# Altium project Audio_Blade_Mic_Array.PrjPcb (part 3 of 3)

## Sheet CPLD_2.SchDoc: Intel Max 10 CPLD: Power & GPIO
size 279 x 215 mm; CompanyName: Flat Earth Inc.; DrawnBy: Connor Dack; Engineer: Connor Dack; Address1: 985 Technology Blvd; Address2: Suite 102; Address3: Bozeman, MT, 59718; DocumentNumber: 7; Revision: 0.0; SheetNumber: 7; SheetTotal: 8
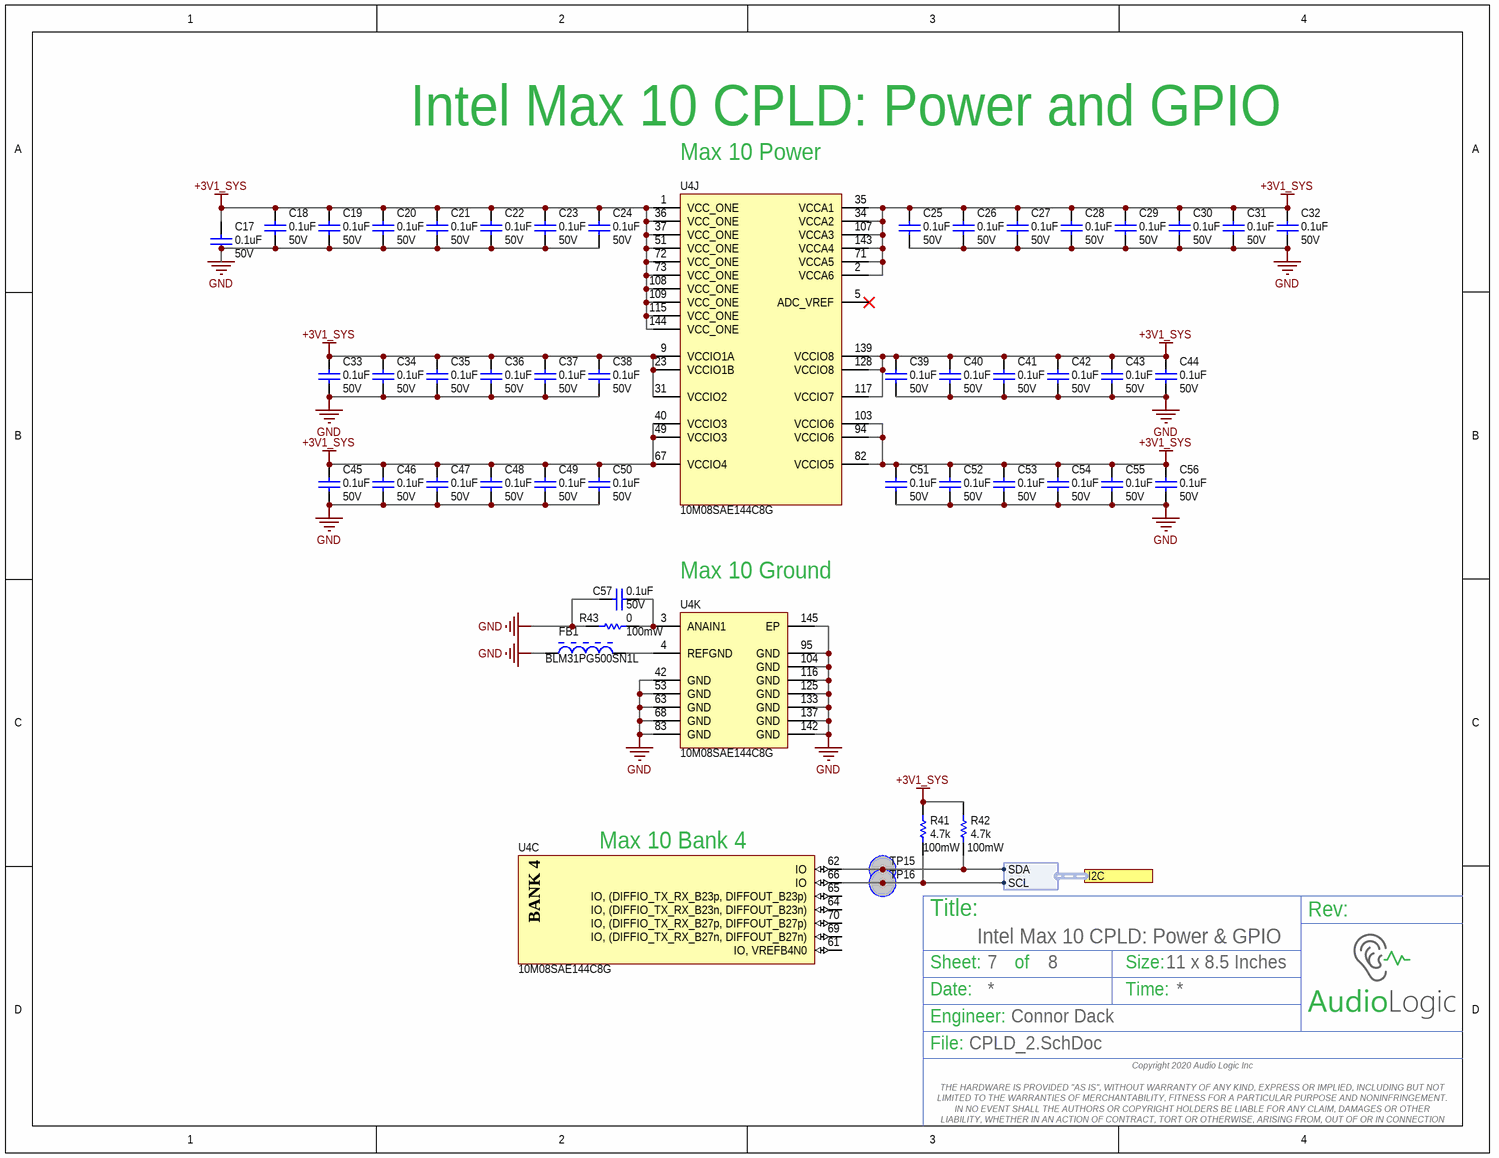
[diagram p6: CPLD_2.SchDoc]

### Parts
C17  Capacitance: 0.1uF  Voltage Rating: 50V  [2-0402_L]  (hidden comment: UMK105B7104KVHF)
C18  Capacitance: 0.1uF  Voltage Rating: 50V  [2-0402_L]  (hidden comment: UMK105B7104KVHF)
C19  Capacitance: 0.1uF  Voltage Rating: 50V  [2-0402_L]  (hidden comment: UMK105B7104KVHF)
C20  Capacitance: 0.1uF  Voltage Rating: 50V  [2-0402_L]  (hidden comment: UMK105B7104KVHF)
C21  Capacitance: 0.1uF  Voltage Rating: 50V  [2-0402_L]  (hidden comment: UMK105B7104KVHF)
C22  Capacitance: 0.1uF  Voltage Rating: 50V  [2-0402_L]  (hidden comment: UMK105B7104KVHF)
C23  Capacitance: 0.1uF  Voltage Rating: 50V  [2-0402_L]  (hidden comment: UMK105B7104KVHF)
C24  Capacitance: 0.1uF  Voltage Rating: 50V  [2-0402_L]  (hidden comment: UMK105B7104KVHF)
C25  Capacitance: 0.1uF  Voltage Rating: 50V  [2-0402_L]  (hidden comment: UMK105B7104KVHF)
C26  Capacitance: 0.1uF  Voltage Rating: 50V  [2-0402_L]  (hidden comment: UMK105B7104KVHF)
C27  Capacitance: 0.1uF  Voltage Rating: 50V  [2-0402_L]  (hidden comment: UMK105B7104KVHF)
C28  Capacitance: 0.1uF  Voltage Rating: 50V  [2-0402_L]  (hidden comment: UMK105B7104KVHF)
C29  Capacitance: 0.1uF  Voltage Rating: 50V  [2-0402_L]  (hidden comment: UMK105B7104KVHF)
C30  Capacitance: 0.1uF  Voltage Rating: 50V  [2-0402_L]  (hidden comment: UMK105B7104KVHF)
C31  Capacitance: 0.1uF  Voltage Rating: 50V  [2-0402_L]  (hidden comment: UMK105B7104KVHF)
C32  Capacitance: 0.1uF  Voltage Rating: 50V  [2-0402_L]  (hidden comment: UMK105B7104KVHF)
C33  Capacitance: 0.1uF  Voltage Rating: 50V  [2-0402_L]  (hidden comment: UMK105B7104KVHF)
C34  Capacitance: 0.1uF  Voltage Rating: 50V  [2-0402_L]  (hidden comment: UMK105B7104KVHF)
C35  Capacitance: 0.1uF  Voltage Rating: 50V  [2-0402_L]  (hidden comment: UMK105B7104KVHF)
C36  Capacitance: 0.1uF  Voltage Rating: 50V  [2-0402_L]  (hidden comment: UMK105B7104KVHF)
C37  Capacitance: 0.1uF  Voltage Rating: 50V  [2-0402_L]  (hidden comment: UMK105B7104KVHF)
C38  Capacitance: 0.1uF  Voltage Rating: 50V  [2-0402_L]  (hidden comment: UMK105B7104KVHF)
C39  Capacitance: 0.1uF  Voltage Rating: 50V  [2-0402_L]  (hidden comment: UMK105B7104KVHF)
C40  Capacitance: 0.1uF  Voltage Rating: 50V  [2-0402_L]  (hidden comment: UMK105B7104KVHF)
C41  Capacitance: 0.1uF  Voltage Rating: 50V  [2-0402_L]  (hidden comment: UMK105B7104KVHF)
C42  Capacitance: 0.1uF  Voltage Rating: 50V  [2-0402_L]  (hidden comment: UMK105B7104KVHF)
C43  Capacitance: 0.1uF  Voltage Rating: 50V  [2-0402_L]  (hidden comment: UMK105B7104KVHF)
C44  Capacitance: 0.1uF  Voltage Rating: 50V  [2-0402_L]  (hidden comment: UMK105B7104KVHF)
C45  Capacitance: 0.1uF  Voltage Rating: 50V  [2-0402_L]  (hidden comment: UMK105B7104KVHF)
C46  Capacitance: 0.1uF  Voltage Rating: 50V  [2-0402_L]  (hidden comment: UMK105B7104KVHF)
C47  Capacitance: 0.1uF  Voltage Rating: 50V  [2-0402_L]  (hidden comment: UMK105B7104KVHF)
C48  Capacitance: 0.1uF  Voltage Rating: 50V  [2-0402_L]  (hidden comment: UMK105B7104KVHF)
C49  Capacitance: 0.1uF  Voltage Rating: 50V  [2-0402_L]  (hidden comment: UMK105B7104KVHF)
C50  Capacitance: 0.1uF  Voltage Rating: 50V  [2-0402_L]  (hidden comment: UMK105B7104KVHF)
C51  Capacitance: 0.1uF  Voltage Rating: 50V  [2-0402_L]  (hidden comment: UMK105B7104KVHF)
C52  Capacitance: 0.1uF  Voltage Rating: 50V  [2-0402_L]  (hidden comment: UMK105B7104KVHF)
C53  Capacitance: 0.1uF  Voltage Rating: 50V  [2-0402_L]  (hidden comment: UMK105B7104KVHF)
C54  Capacitance: 0.1uF  Voltage Rating: 50V  [2-0402_L]  (hidden comment: UMK105B7104KVHF)
C55  Capacitance: 0.1uF  Voltage Rating: 50V  [2-0402_L]  (hidden comment: UMK105B7104KVHF)
C56  Capacitance: 0.1uF  Voltage Rating: 50V  [2-0402_L]  (hidden comment: UMK105B7104KVHF)
C57  Capacitance: 0.1uF  Voltage Rating: 50V  [2-0402_L]  (hidden comment: UMK105B7104KVHF)
FB1  BLM31PG500SN1L  [MURA-BLM31-B35-CHIP-2_V1]
R41  Power (Watts): 100mW  Resistance (Ohms): 4.7k  [3-0603_R_L]  (hidden comment: ERJ-3EKF4701V)
R42  Power (Watts): 100mW  Resistance (Ohms): 4.7k  [3-0603_R_L]  (hidden comment: ERJ-3EKF4701V)
R43  Resistance: 0  Power Rating: 100mW  [RESC1005X40X25LL05T10]  (hidden comment: ERJ-2GE0R00X)
TP15  Testpoint  [Testpoint_SMT]  (value not drawn)  (no BOM)
TP16  Testpoint  [Testpoint_SMT]  (value not drawn)  (no BOM)
U4  10M08SAE144C8G  [ALTR-EQFP144_A165_D2-500_M]  (parts C,J,K of 11)

### Ports
I2C (harness I2C)

### Harnesses
I2C: SCL, SDA

### Nets
+3V1_SYS: C17.1 C18.1 C19.1 C20.1 C21.1 C22.1 C23.1 C24.1 C25.1 C26.1 C27.1 C28.1 C29.1 C30.1 C31.1 C32.1 C33.1 C34.1 C35.1 C36.1 C37.1 C38.1 C39.1 C40.1 C41.1 C42.1 C43.1 C44.1 C45.1 C46.1 C47.1 C48.1 C49.1 C50.1 C51.1 C52.1 C53.1 C54.1 C55.1 C56.1 R41.2 R42.2 U4.1(VCC_ONE) U4.2(VCCA6) U4.9(VCCIO1A) U4.23(VCCIO1B) U4.31(VCCIO2) U4.34(VCCA2) U4.35(VCCA1) U4.36(VCC_ONE) U4.37(VCC_ONE) U4.40(VCCIO3) U4.49(VCCIO3) U4.51(VCC_ONE) U4.67(VCCIO4) U4.71(VCCA5) U4.72(VCC_ONE) U4.73(VCC_ONE) U4.82(VCCIO5) U4.94(VCCIO6) U4.103(VCCIO6) U4.107(VCCA3) U4.108(VCC_ONE) U4.109(VCC_ONE) U4.115(VCC_ONE) U4.117(VCCIO7) U4.128(VCCIO8) U4.139(VCCIO8) U4.143(VCCA4) U4.144(VCC_ONE)
GND: C17.2 C18.2 C19.2 C20.2 C21.2 C22.2 C23.2 C24.2 C25.2 C26.2 C27.2 C28.2 C29.2 C30.2 C31.2 C32.2 C33.2 C34.2 C35.2 C36.2 C37.2 C38.2 C39.2 C40.2 C41.2 C42.2 C43.2 C44.2 C45.2 C46.2 C47.2 C48.2 C49.2 C50.2 C51.2 C52.2 C53.2 C54.2 C55.2 C56.2 C57.2 FB1.1 R43.1 U4.42(GND) U4.53(GND) U4.63(GND) U4.68(GND) U4.83(GND) U4.95(GND) U4.104(GND) U4.116(GND) U4.125(GND) U4.133(GND) U4.137(GND) U4.142(GND) U4.145(EP)
SCL: R41.1 TP16.1 U4.66(IO) ; port I2C.SCL
SDA: R42.1 TP15.1 U4.62(IO) ; port I2C.SDA
NetC57_1: C57.1 R43.2 U4.3(ANAIN1)
NetFB1_2: FB1.2 U4.4(REFGND)

Not connected (* = marked no-connect by the designer): U4 5(ADC_VREF)* 61(IO,_VREFB4N0) 64(IO,_(DIFFIO_TX_RX_B23n,_DIFFOUT_B23n)) 65(IO,_(DIFFIO_TX_RX_B23p,_DIFFOUT_B23p)) 69(IO,_(DIFFIO_TX_RX_B27n,_DIFFOUT_B27n)) 70(IO,_(DIFFIO_TX_RX_B27p,_DIFFOUT_B27p))

### Notes on the sheet
- Intel Max 10 CPLD: Power and GPIO
- (near U4) Max 10 Power
- Max 10 Ground
- Max 10 Bank 4
- Title:
- Sheet:
- of
- Size:
- 11 x 8.5 Inches
- Rev:
- Date:
- Engineer:
- Time:
- File:
- Copyright 2020 Audio Logic Inc
  THE HARDWARE IS PROVIDED "AS IS", WITHOUT WARRANTY OF ANY KIND, EXPRESS OR IMPLIED, INCLUDING BUT NOT LIMITED TO THE WARRANTIES OF MERCHANTABILITY, FITNESS FOR A PARTICULAR PURPOSE AND NONINFRINGEMENT. IN NO EVENT SHALL THE AUTHORS OR COPYRIGHT HOLDERS BE LIABLE FOR ANY CLAIM, DAMAGES OR OTHER LIABILITY, WHETHER IN AN ACTION OF CONTRACT, TORT OR OTHERWISE, ARISING FROM, OUT OF OR IN CONNECTION WITH THE HARDWARE OR THE USE OR OTHER DEALINGS IN THE HARDWARE.
- (in symbol 10M08SAE144C8G, part C) BANK 4

### Library data of the parts
C17-C57 = UMK105B7104KVHF: CAP CER 0.1uF 50V X7R +/-10% 0402 AEC-Q200; Manufacturer: Taiyo Yuden; Tolerance: 10%; Supplier 1: Digi-Key; Manufacturer Part Number: UMK105B7104KVHF; Stock 1: 100000; Pricing 1: 1=0.23, 10=0.165, 100=0.0775, 500=0.05436, 1000=0.04501, 2500=0.04189, 5000=0.03832 (USD); Packaging: Tape and Reel; ComponentLink1URL: http://www.yuden.co.jp/productdata/catalog/en/mlcc01_hq_e.pdf; ComponentLink1Description: http://www.yuden.co.jp/productdata/catalog/en/mlcc01_hq_e.pdf; Supplier Part Number 1: 587-4330-1-ND; Mount: Surface Mount; Case/Package: 0402; Case Code (Metric): 1005; Case Code (Imperial): 0402; Min Operating Temperature: -55°C; Max Operating Temperature: 125°C; Package Quantity: 10000; Dielectric: X7R; Voltage Rating (DC): 50V; Length: 0.039inch; Height: 0.5mm; Width: 0.02inch; Thickness: 0.022inch; ComponentLink2URL: http://ds.yuden.co.jp/TYCOMPAS/ut/detail.do?productNo=UMK105B7104KVHF&fileName=UMK105B7104KVHF_SS&mode=specSheetDownload; ComponentLink2Description: http://ds.yuden.co.jp/TYCOMPAS/ut/detail.do?productNo=UMK105B7104KVHF&fileName=UMK105B7104KVHF_SS&mode=specSheetDownload; ComponentLink3URL: http://www.mouser.com/ds/2/396/mlcc11_hq_e-541564.pdf; ComponentLink3Description: http://www.mouser.com/ds/2/396/mlcc11_hq_e-541564.pdf; ComponentLink4URL: http://ds.yuden.co.jp/TYCOMPAS/ut/detail.do?productNo=UMK105B7104KVHF&dataUnit=M; ComponentLink4Description: http://ds.yuden.co.jp/TYCOMPAS/ut/detail.do?productNo=UMK105B7104KVHF&dataUnit=M; Weight: 2.3E-05oz; Termination: SMD/SMT
FB1 = CMP-0686-00735-2: Chip Ferrite Bead for Power Lines, 50 Ohm, 3500 mA, -55 to 125 degC, 3.2 x 1.6 x 1.3 mm SMD, Tape and Reel; Manufacturer: Murata; DC Resistance: 0.015 Ohm Max.; Rated Current: 3500 mA; Impedance (at 100 MHz): 50 Ohm Typ.; ComponentLink1Description: Manufacturer URL; DatasheetVersion: 08/2013; PackageReference: BLM31-2; ComponentLink1URL: http://www.murata.com/; ComponentLink3URL: http://www.murata.com/products/catalog/pdf/c31e.pdf; Packing: Tape and Reel; PartNumber: BLM31PG500SN1L; PackageDescription: 2-Pin Chip, Body 3.2 x 1.6 mm; ComponentLink3Description: Package Specification; ComponentLink2URL: http://www.murata.com/products/catalog/pdf/c31e.pdf; Operating Temperature Range: -55 to 125 degC; Mounting Technology: Surface Mount; ComponentLink2Description: Datasheet
R41 R42 = ERJ-3EKF4701V: RES SMD 4.7K OHM 1% 1/10W 0603; Manufacturer: Panasonic Electronic Components; Temperature Coefficient: ±100ppm/°C; Supplier 1: Digi-Key; Manufacturer Part Number: ERJ-3EKF4701V; RoHS: RoHS Compliant; Category: Resistors; Stock 1: 1874817; Pricing 1: 1=0.1, 50=0.0114, 100=0.0084, 250=0.00644, 500=0.00514, 1000=0.00379 (USD); Packaging: Cut Tape (CT); Part Status: Active; Tolerance: ±1%; Composition: Thick Film; Features: Automotive AEC-Q200; Operating Temperature: -55°C ~ 155°C; Package / Case: 0603 (1608 Metric); Supplier Device Package: 0603; Size / Dimension: 0.063" L x 0.031" W (1.60mm x 0.80mm); Height: 0.022" (0.55mm); Number of Terminations: 2; ComponentLink1URL: http://industrial.panasonic.com/www-cgi/jvcr13pz.cgi?E+PZ+3+AOA0002+ERJ3EKF4701V+7+WW; ComponentLink1Description: http://industrial.panasonic.com/www-cgi/jvcr13pz.cgi?E+PZ+3+AOA0002+ERJ3EKF4701V+7+WW; Supplier Part Number 1: P4.70KHCT-ND
R43 = CMP-2002-06455-1: RES SMD 0 OHM JUMPER 1/10W 0402; Manufacturer: Panasonic; Part Number: ERJ-S020R00X; Voltage Rating: 50V; Tolerance: 5%; Temperature Coefficient: 600ppm/°C; Supplier 1: Digi-Key; Supplier Part Number 1: P0.0JCT-ND; Manufacturer Part Number: ERJ-2GE0R00X; RoHS: Yes; Category: Chip SMD Resistors; Stock 1: 18087276; Pricing 1: 1=0.10000, 10=0.03000, 25=0.02160, 50=0.01640, 100=0.01210, 250=0.00924, 500=0.00740, 1000=0.00545, 5000=0.00391 (USD); Mount: Surface Mount; Case/Package: 0402; Case Code (Metric): 1005; Case Code (Imperial): 0402; Contact Plating: Tin; Min Operating Temperature: -55°C; Max Operating Temperature: 155°C; Packaging: Tape and Reel; Package Quantity: 1; Composition: Thick Film; Number of Terminations: 2; Max Power Dissipation: 100mW; Termination: SMD/SMT; Military Standard: Not; Voltage Rating (DC): 50V; Features: Automotive AEC-Q200; Length: 1mm; Height: 0.35mm; Width: 0.02inch; Depth: 0.5mm; Radiation Hardening: No; Lead Free: Lead Free; REACH SVHC: No SVHC; ComponentLink1URL: https://datasheet.ciiva.com/11821/0900766b80f806dd-11821176.pdf?src-supplier=RSComponents; ComponentLink1Description: https://datasheet.ciiva.com/11821/0900766b80f806dd-11821176.pdf?src-supplier=RSComponents; ComponentLink2URL: https://datasheet.ciiva.com/46389/1678796-46389518.pdf?src-supplier=Element14; ComponentLink2Description: https://datasheet.ciiva.com/46389/1678796-46389518.pdf?src-supplier=Element14; ComponentLink3URL: https://datasheet.ciiva.com/16778/70260739-16778335.pdf?src-supplier=Allied+Electronics; ComponentLink3Description: https://datasheet.ciiva.com/16778/70260739-16778335.pdf?src-supplier=Allied+Electronics; ComponentLink4URL: https://datasheet.ciiva.com/16783/70260739-16783734.pdf?src-supplier=Allied+Electronics; ComponentLink4Description: https://datasheet.ciiva.com/16783/70260739-16783734.pdf?src-supplier=Allied+Electronics; ComponentLink5URL: https://datasheet.ciiva.com/17215/aoa0000ce1-17215386.pdf?src-supplier=Avnet+Europe; ComponentLink5Description: https://datasheet.ciiva.com/17215/aoa0000ce1-17215386.pdf?src-supplier=Avnet+Europe; ComponentLink6URL: https://datasheet.ciiva.com/5959/1678796-5959692.pdf?src-supplier=Farnell; ComponentLink6Description: https://datasheet.ciiva.com/5959/1678796-5959692.pdf?src-supplier=Farnell; ComponentLink7URL: https://datasheet.ciiva.com/48531/aoa0000ce1-48531077.pdf?src-supplier=Avnet; ComponentLink7Description: https://datasheet.ciiva.com/48531/aoa0000ce1-48531077.pdf?src-supplier=Avnet; ComponentLink8URL: https://datasheet.ciiva.com/43460/1678796-43460347.pdf?src-supplier=Farnell; ComponentLink8Description: https://datasheet.ciiva.com/43460/1678796-43460347.pdf?src-supplier=Farnell; ComponentLink9URL: https://datasheet.ciiva.com/30097/4aoa0000ce1-30097116.pdf?src-supplier=Onlinecomponents.com; ComponentLink9Description: https://datasheet.ciiva.com/30097/4aoa0000ce1-30097116.pdf?src-supplier=Onlinecomponents.com; ComponentLink10URL: https://datasheet.ciiva.com/28695/1678796-28695758.pdf?src-supplier=Element14; ComponentLink10Description: https://datasheet.ciiva.com/28695/1678796-28695758.pdf?src-supplier=Element14
TP15 TP16 = Testpoint_SMT: Testpoint, 1-Pin, SMT; System: Connector
U4 = 10M08SAE144C8G: MAX 10 Family FPGA, 1.15 to 1.25 V Supply, 101 GPIO Pins, 8 K Logic Elements, 144-Pin EQFP, Speed Grade 8, Commercial Grade, RoHS Compliant, Engineering Sample; Manufacturer: Altera; Package Version: Rev. 2.0, 03/2015; Package Reference: EQFP144_A165_D2-500; Package Description: 144-Pin Plastic Enhanced Quad Flat Package, Body 20 x 20 mm, Pitch 0.5 mm; Manufacturer URL: https://www.altera.com/; Datasheet Version: Jan-16; Package URL: https://www.altera.com/content/dam/altera-www/global/en_US/pdfs/literature/packaging/04r00476-01.pdf; Datasheet URL: http://www.altera.com/literature/hb/max-10/m10_datasheet.pdf

## Sheet System_Architecture.SchDoc: System Architecture
size 279 x 215 mm; CompanyName: Flat Earth Inc.; DrawnBy: Connor Dack; Engineer: Connor Dack; Address1: 985 Technology Blvd; Address2: Suite 102; Address3: Bozeman, MT, 59718; DocumentNumber: 3; Revision: 0.0; SheetNumber: 3; SheetTotal: 8
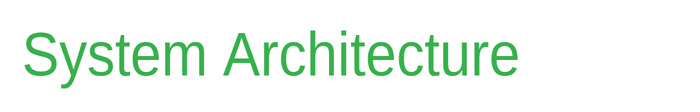
[diagram p7: System_Architecture.SchDoc]

### Notes on the sheet
- System Architecture
- Title:
- Sheet:
- of
- Size:
- 11 x 8.5 Inches
- Rev:
- Date:
- Engineer:
- Time:
- File:
- Copyright 2020 Audio Logic Inc
  THE HARDWARE IS PROVIDED "AS IS", WITHOUT WARRANTY OF ANY KIND, EXPRESS OR IMPLIED, INCLUDING BUT NOT LIMITED TO THE WARRANTIES OF MERCHANTABILITY, FITNESS FOR A PARTICULAR PURPOSE AND NONINFRINGEMENT. IN NO EVENT SHALL THE AUTHORS OR COPYRIGHT HOLDERS BE LIABLE FOR ANY CLAIM, DAMAGES OR OTHER LIABILITY, WHETHER IN AN ACTION OF CONTRACT, TORT OR OTHERWISE, ARISING FROM, OUT OF OR IN CONNECTION WITH THE HARDWARE OR THE USE OR OTHER DEALINGS IN THE HARDWARE.

## Nets that join several sheets
+3V1_SYS: RJ45_Power_Reg (14 pins), CPLD (18 pins), Peripherals (55 pins), CPLD_2 (70 pins)
GND: RJ45_Power_Reg (31 pins), CPLD (17 pins), Peripherals (43 pins), CPLD_2 (56 pins)
MIC_SCK_1: CPLD (R32.1), Peripherals (MK1.6)
MIC_SCK_2: CPLD (R31.1), Peripherals (MK2.6)
MIC_SCK_3: CPLD (R25.1), Peripherals (MK3.6)
MIC_SCK_4: CPLD (R24.1), Peripherals (MK4.6)
MIC_SCK_5: CPLD (R26.1), Peripherals (MK5.6)
MIC_SCK_6: CPLD (R30.1), Peripherals (MK6.6)
MIC_SCK_7: CPLD (R22.1), Peripherals (MK7.6)
MIC_SCK_8: CPLD (R23.1), Peripherals (MK8.6)
MIC_SCK_9: CPLD (R34.1), Peripherals (MK9.6)
MIC_SCK_10: CPLD (R33.1), Peripherals (MK10.6)
MIC_SCK_11: CPLD (R38.1), Peripherals (MK11.6)
MIC_SCK_12: CPLD (R37.1), Peripherals (MK12.6)
MIC_SCK_13: CPLD (R35.1), Peripherals (MK13.6)
MIC_SCK_14: CPLD (R36.1), Peripherals (MK14.6)
MIC_SCK_15: CPLD (R39.1), Peripherals (MK15.6)
MIC_SCK_16: CPLD (R40.1), Peripherals (MK16.6)
MIC_SD_1: CPLD (TP14.1 U4.25), Peripherals (R44.1)
MIC_SD_2: CPLD (U4.43), Peripherals (R45.1)
MIC_SD_3: CPLD (U4.57), Peripherals (R46.1)
MIC_SD_4: CPLD (U4.84), Peripherals (R47.1)
MIC_SD_5: CPLD (U4.32), Peripherals (R48.1)
MIC_SD_6: CPLD (U4.38), Peripherals (R49.1)
MIC_SD_7: CPLD (U4.78), Peripherals (R50.1)
MIC_SD_8: CPLD (U4.76), Peripherals (R51.1)
MIC_SD_9: CPLD (U4.6), Peripherals (R52.1)
MIC_SD_10: CPLD (U4.140), Peripherals (R54.1)
MIC_SD_11: CPLD (U4.106), Peripherals (R55.1)
MIC_SD_12: CPLD (U4.100), Peripherals (R56.1)
MIC_SD_13: CPLD (U4.11), Peripherals (R57.1)
MIC_SD_14: CPLD (U4.135), Peripherals (R58.1)
MIC_SD_15: CPLD (U4.119), Peripherals (R59.1)
MIC_SD_16: CPLD (U4.92), Peripherals (R60.1)
MIC_WS_1: CPLD (TP9.1 U4.30), Peripherals (MK1.5)
MIC_WS_2: CPLD (U4.46), Peripherals (MK2.5)
MIC_WS_3: CPLD (U4.60), Peripherals (MK3.5)
MIC_WS_4: CPLD (U4.87), Peripherals (MK4.5)
MIC_WS_5: CPLD (U4.33), Peripherals (MK5.5)
MIC_WS_6: CPLD (U4.41), Peripherals (MK6.5)
MIC_WS_7: CPLD (U4.74), Peripherals (MK7.5)
MIC_WS_8: CPLD (U4.80), Peripherals (MK8.5)
MIC_WS_9: CPLD (U4.8), Peripherals (MK9.5)
MIC_WS_10: CPLD (U4.7), Peripherals (MK10.5)
MIC_WS_11: CPLD (U4.98), Peripherals (MK11.5)
MIC_WS_12: CPLD (U4.102), Peripherals (MK12.5)
MIC_WS_13: CPLD (U4.14), Peripherals (MK13.5)
MIC_WS_14: CPLD (U4.141), Peripherals (MK14.5)
MIC_WS_15: CPLD (U4.122), Peripherals (MK15.5)
MIC_WS_16: CPLD (U4.96), Peripherals (MK16.5)
NetR1_1: RJ45_Power_Reg (R1.1 R2.2), CPLD (TP10.1 U4.55)
NetR13_2: RJ45_Power_Reg (R13.2 R15.2), CPLD (TP11.1 U4.59)
NetR17_2: RJ45_Power_Reg (R17.2 U3.9), CPLD (U4.58)
RJ45_SCK: RJ45_Power_Reg (TP4.1 U3.15), CPLD (U4.50)
RJ45_SDI: RJ45_Power_Reg (TP5.1 U3.14), CPLD (U4.52)
RJ45_SDO: RJ45_Power_Reg (TP6.1 U3.11), CPLD (U4.54)
SCL: RJ45_Power_Reg (U1.5), Peripherals (U9.4 U10.9), CPLD_2 (R41.1 TP16.1 U4.66)
SDA: RJ45_Power_Reg (U1.6), Peripherals (U9.3 U10.7), CPLD_2 (R42.1 TP15.1 U4.62)

## Assembly variants
BUILD: not fitted R3 R16